# Altium schematic sheet CPU_GPIO.SchDoc
size 420 x 297 mm; Scale: 1:1; DocumentType: Схема электрическая принципиальная; SheetNumber: 11; SheetTotal: 32; DocumentTypeShort: Э3; DocumentInvertoryNumber: ㅤ
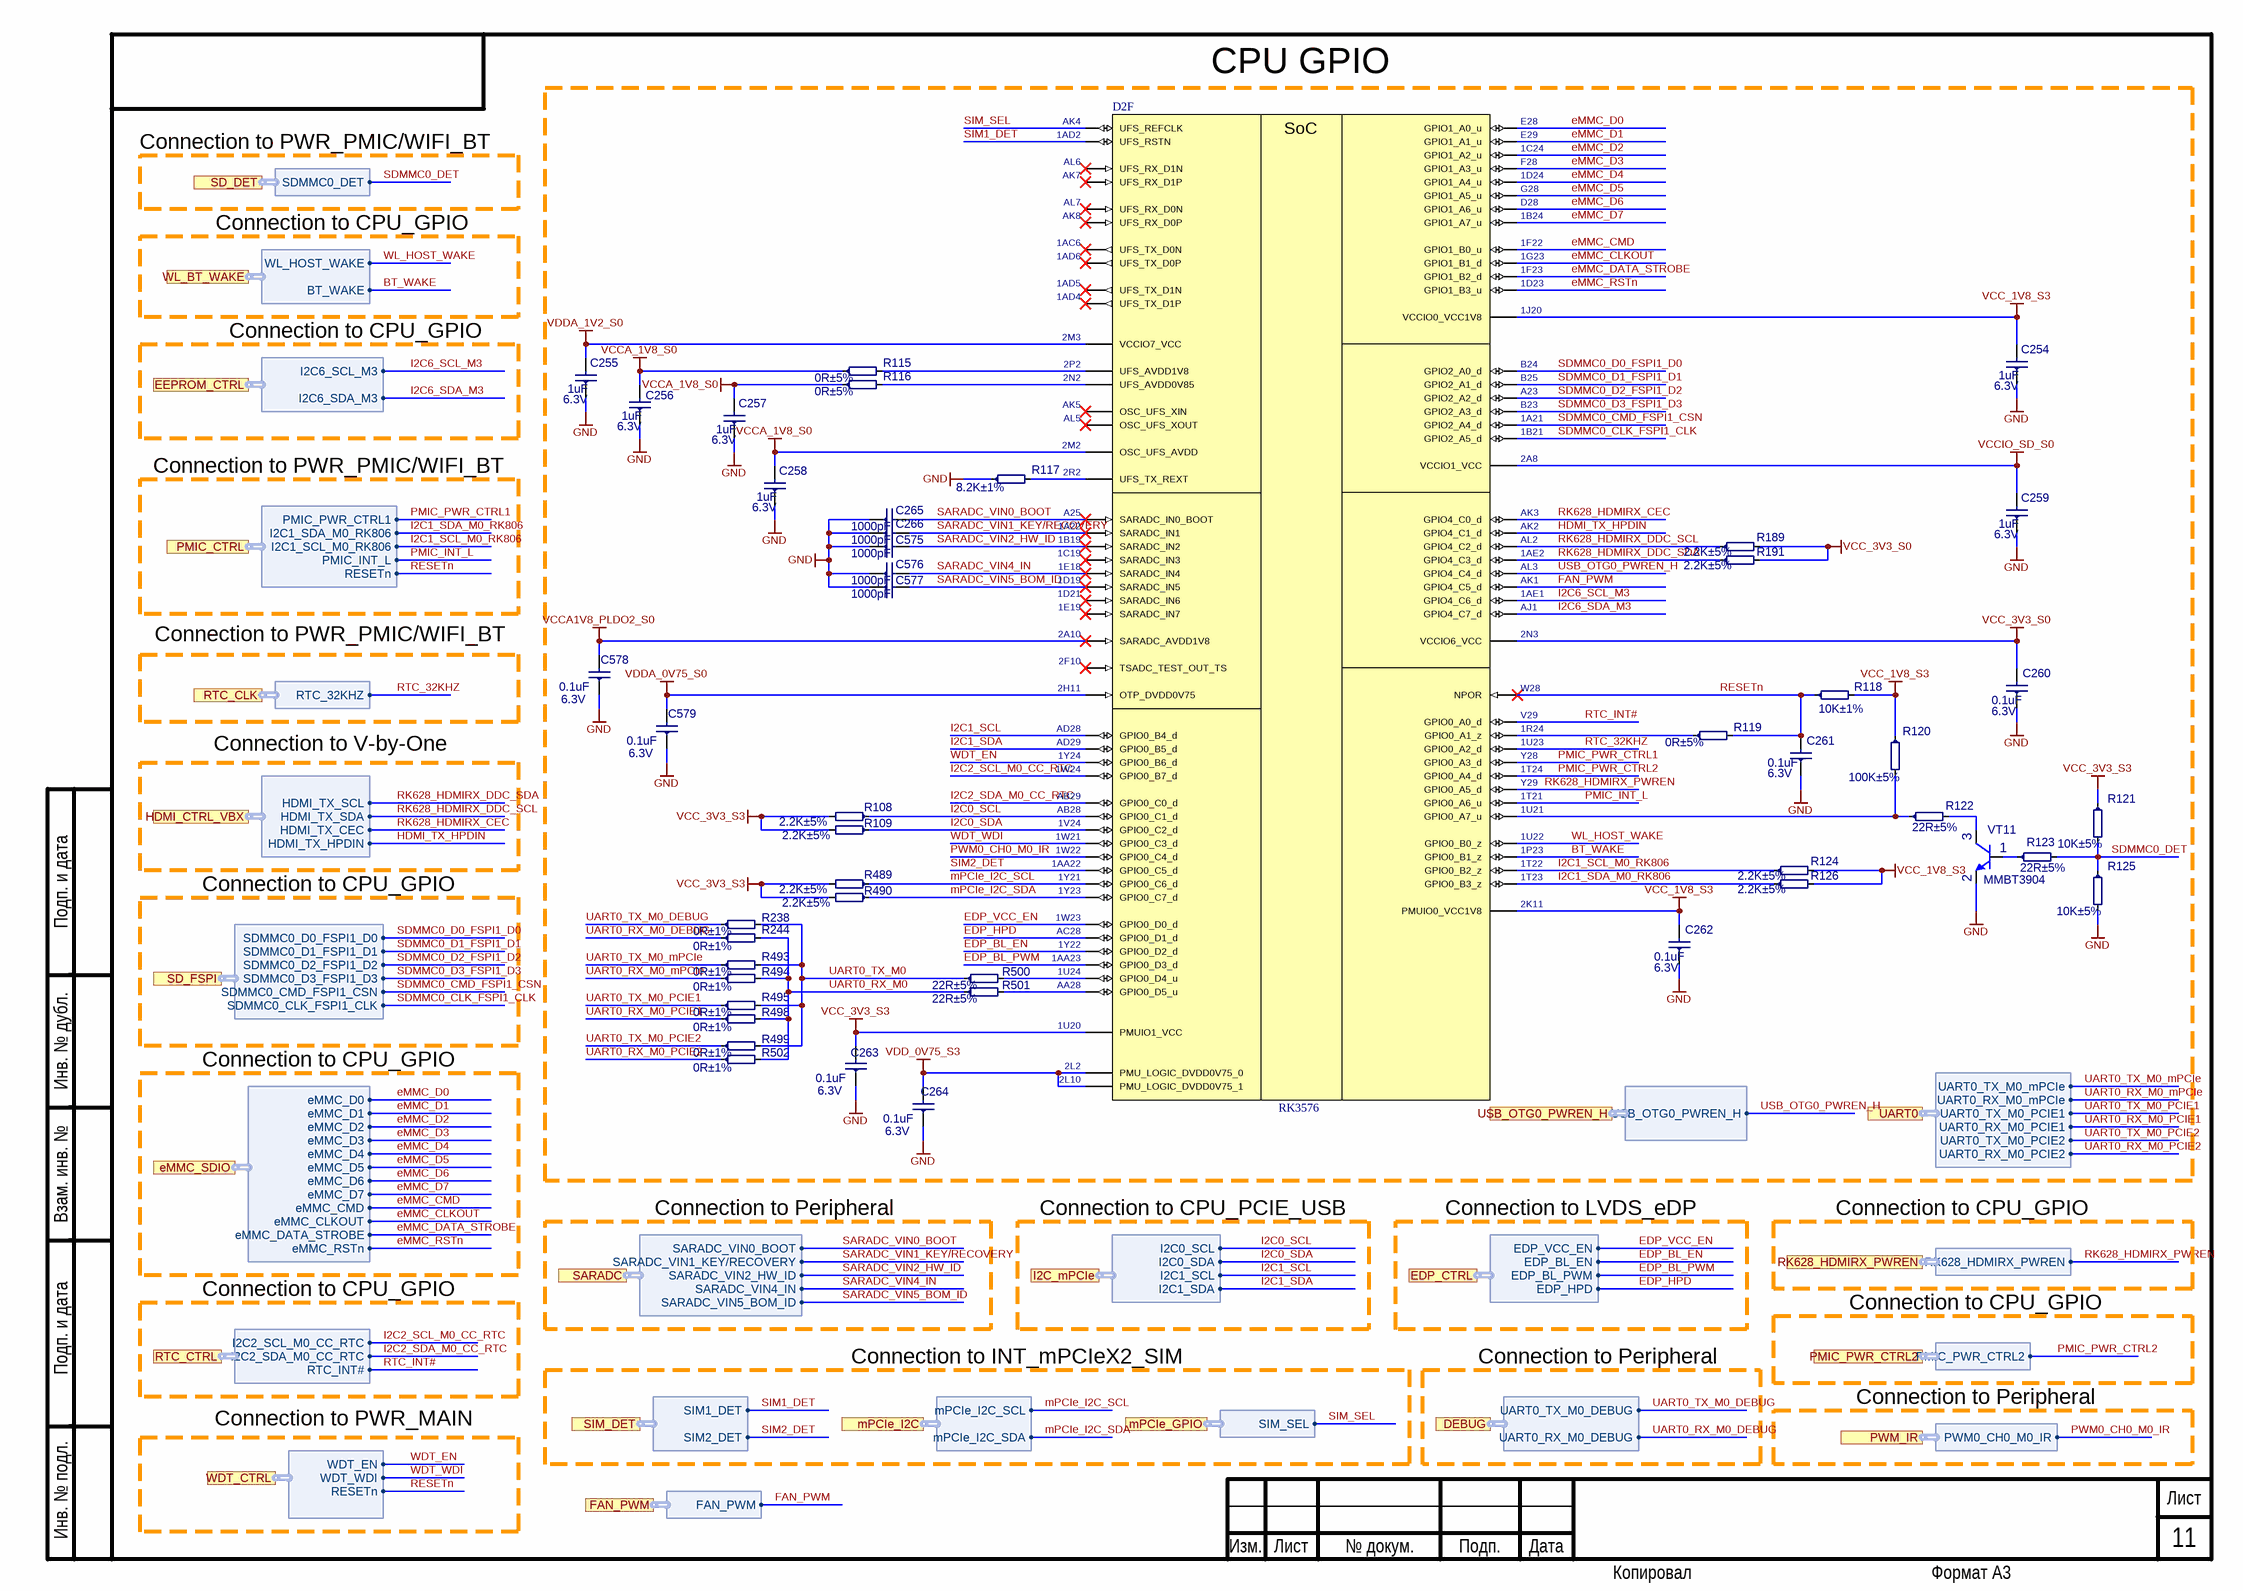
[diagram p0: CPU_GPIO.SchDoc]

## Parts
C254  1uF  Voltage: 6.3V  [C0201]
C255  1uF  Voltage: 6.3V  [C0201]
C256  1uF  Voltage: 6.3V  [C0201]
C257  1uF  Voltage: 6.3V  [C0201]
C258  1uF  Voltage: 6.3V  [C0201]
C259  1uF  Voltage: 6.3V  [C0201]
C260  0.1uF  Voltage: 6.3V  [C0201]
C261  0.1uF  Voltage: 6.3V  [C0201]
C262  0.1uF  Voltage: 6.3V  [C0201]
C263  0.1uF  Voltage: 6.3V  [C0201]
C264  0.1uF  Voltage: 6.3V  [C0201]
C265  1000pF  [C0201]
C266  1000pF  [C0201]
C575  1000pF  [C0201]
C576  1000pF  [C0201]
C577  1000pF  [C0201]
C578  0.1uF  Voltage: 6.3V  [C0201]
C579  0.1uF  Voltage: 6.3V  [C0201]
D2  RK3576  [BGAFCCSP698L]  (part F of 7)
R108  2.2K±5%  [R0402]
R109  2.2K±5%  [R0402]
R115  0R±5%  [R0201]
R116  0R±5%  [R0201]
R117  8.2K±1%  [R0402]
R118  10K±1%  [R0201]
R119  0R±5%  [R0201]
R120  100K±5%  [R0402]
R121  10K±5%  [R0402]
R122  22R±5%  [R0402]
R123  22R±5%  [R0402]
R124  2.2K±5%  [R0402]
R125  10K±5%  [R0402]
R126  2.2K±5%  [R0402]
R189  2.2K±5%  [R0402]
R191  2.2K±5%  [R0402]
R238  0R±1%  [R0402]
R244  0R±1%  [R0402]
R489  2.2K±5%  [R0402]
R490  2.2K±5%  [R0402]
R493  0R±1%  [R0402]
R494  0R±1%  [R0402]
R495  0R±1%  [R0402]
R498  0R±1%  [R0402]
R499  0R±1%  [R0402]
R500  22R±5%  [R0402]
R501  22R±5%  [R0402]
R502  0R±1%  [R0402]
VT11  MMBT3904  [SOT23]

## Ports
DEBUG (harness DEBUG), EDP_CTRL (harness EDP_CTRL), EEPROM_CTRL (harness EEPROM_CTRL), eMMC_SDIO (harness eMMC_SDIO), FAN_PWM (harness FAN_PWM), HDMI_CTRL_VBX (harness HDMI_CTRL_VBX), I2C_mPCIe (harness I2C_mPCIe), mPCIe_GPIO (harness mPCIe_GPIO), mPCIe_I2C (harness mPCIe_I2C), PMIC_CTRL (harness PMIC_CTRL), PMIC_PWR_CTRL2 (harness PMIC_PWR_CTRL2), PWM_IR (harness PWM0_IR), RK628_HDMIRX_PWREN (harness RK628_HDMIRX_PWREN), RTC_CLK (harness RTC_CLK), RTC_CTRL (harness RTC_CTRL), SARADC (harness SARADC), SD_DET (harness SD_DET), SD_FSPI (harness SD_FSPI), SIM_DET (harness SIM_DET), UART0 (harness UART0), USB_OTG0_PWREN_H (harness USB_OTG0_PWREN_H), WDT_CTRL (harness WDT_CTRL), WL_BT_WAKE (harness WL_BT_WAKE)

## Harnesses
WDT_CTRL: WDT_WDI, WDT_EN, RESETn
RTC_CLK: RTC_32KHZ
RTC_CTRL: I2C2_SCL_M0_CC_RTC, I2C2_SDA_M0_CC_RTC, RTC_INT#
eMMC_SDIO: eMMC_D0, eMMC_D1, eMMC_D2, eMMC_D3, eMMC_D4, eMMC_D5, eMMC_D6, eMMC_D7, eMMC_CMD, eMMC_CLKOUT, eMMC_DATA_STROBE, eMMC_RSTn
SD_FSPI: SDMMC0_D0_FSPI1_D0, SDMMC0_D1_FSPI1_D1, SDMMC0_D2_FSPI1_D2, SDMMC0_D3_FSPI1_D3, SDMMC0_CMD_FSPI1_CSN, SDMMC0_CLK_FSPI1_CLK
EEPROM_CTRL: I2C6_SCL_M3, I2C6_SDA_M3
SD_DET: SDMMC0_DET
WL_BT_WAKE: WL_HOST_WAKE, BT_WAKE
HDMI_CTRL_VBX: HDMI_TX_SDA, HDMI_TX_CEC, HDMI_TX_SCL, HDMI_TX_HPDIN
EDP_CTRL: EDP_BL_EN, EDP_BL_PWM, EDP_VCC_EN, EDP_HPD
SARADC: SARADC_VIN4_IN, SARADC_VIN2_HW_ID, SARADC_VIN1_KEY/RECOVERY, SARADC_VIN0_BOOT, SARADC_VIN5_BOM_ID
PMIC_CTRL: I2C1_SDA_M0_RK806, I2C1_SCL_M0_RK806, PMIC_PWR_CTRL1, PMIC_INT_L, RESETn
mPCIe_GPIO: SIM_SEL
SIM_DET: SIM1_DET, SIM2_DET
mPCIe_I2C: mPCIe_I2C_SDA, mPCIe_I2C_SCL
RK628_HDMIRX_PWREN: RK628_HDMIRX_PWREN
PMIC_PWR_CTRL2: PMIC_PWR_CTRL2
PWM0_IR: PWM0_CH0_M0_IR
I2C_mPCIe: I2C0_SDA, I2C1_SCL, I2C0_SCL, I2C1_SDA
DEBUG: UART0_RX_M0_DEBUG, UART0_TX_M0_DEBUG
FAN_PWM: FAN_PWM
UART0: UART0_RX_M0_PCIE2, UART0_TX_M0_PCIE2, UART0_RX_M0_PCIE1, UART0_TX_M0_PCIE1, UART0_RX_M0_mPCIe, UART0_TX_M0_mPCIe
USB_OTG0_PWREN_H: USB_OTG0_PWREN_H

## Nets
GND: C254.1 C255.1 C256.1 C257.1 C258.1 C259.1 C260.1 C261.1 C262.1 C263.1 C264.1 C265.1 C266.1 C575.1 C576.1 C577.1 C578.1 C579.1 R117.1 R125.2 VT11.2(E)
VCC_1V8_S3: C254.2 C262.2 D2.1J20(VCCIO0_VCC1V8) D2.2K11(PMUIO0_VCC1V8) R118.2 R120.1 R124.2 R126.2
VCC_3V3_S0: C260.2 D2.2N3(VCCIO6_VCC) R189.2 R191.2
VCC_3V3_S3: C263.2 D2.1U20(PMUIO1_VCC) R108.2 R109.2 R121.1 R489.2 R490.2
VCCA1V8_PLDO2_S0: C578.2 D2.2A10(SARADC_AVDD1V8)
VCCA_1V8_S0: C256.2 C257.2 C258.2 D2.2M2(OSC_UFS_AVDD) R115.1 R116.1
VCCIO_SD_S0: C259.2 D2.2A8(VCCIO1_VCC)
VDD_0V75_S3: C264.2 D2.2L2(PMU_LOGIC_DVDD0V75_0) D2.2L10(PMU_LOGIC_DVDD0V75_1)
VDDA_0V75_S0: C579.2 D2.2H11(OTP_DVDD0V75)
VDDA_1V2_S0: C255.2 D2.2M3(VCCIO7_VCC)
BT_WAKE: D2.1P23(GPIO0_B1_z) ; port WL_BT_WAKE.BT_WAKE
EDP_BL_EN: D2.1Y22(GPIO0_D2_d) ; port EDP_CTRL.EDP_BL_EN
EDP_BL_PWM: D2.1AA23(GPIO0_D3_d) ; port EDP_CTRL.EDP_BL_PWM
EDP_HPD: D2.AC28(GPIO0_D1_d) ; port EDP_CTRL.EDP_HPD
EDP_VCC_EN: D2.1W23(GPIO0_D0_d) ; port EDP_CTRL.EDP_VCC_EN
eMMC_CLKOUT: D2.1G23(GPIO1_B1_d) ; port eMMC_SDIO.eMMC_CLKOUT
eMMC_CMD: D2.1F22(GPIO1_B0_u) ; port eMMC_SDIO.eMMC_CMD
eMMC_D0: D2.E28(GPIO1_A0_u) ; port eMMC_SDIO.eMMC_D0
eMMC_D1: D2.E29(GPIO1_A1_u) ; port eMMC_SDIO.eMMC_D1
eMMC_D2: D2.1C24(GPIO1_A2_u) ; port eMMC_SDIO.eMMC_D2
eMMC_D3: D2.F28(GPIO1_A3_u) ; port eMMC_SDIO.eMMC_D3
eMMC_D4: D2.1D24(GPIO1_A4_u) ; port eMMC_SDIO.eMMC_D4
eMMC_D5: D2.G28(GPIO1_A5_u) ; port eMMC_SDIO.eMMC_D5
eMMC_D6: D2.D28(GPIO1_A6_u) ; port eMMC_SDIO.eMMC_D6
eMMC_D7: D2.1B24(GPIO1_A7_u) ; port eMMC_SDIO.eMMC_D7
eMMC_DATA_STROBE: D2.1F23(GPIO1_B2_d) ; port eMMC_SDIO.eMMC_DATA_STROBE
eMMC_RSTn: D2.1D23(GPIO1_B3_u) ; port eMMC_SDIO.eMMC_RSTn
FAN_PWM: D2.AK1(GPIO4_C5_d) ; port FAN_PWM.FAN_PWM
HDMI_TX_HPDIN: D2.AK2(GPIO4_C1_d) ; port HDMI_CTRL_VBX.HDMI_TX_HPDIN
I2C0_SCL: D2.AB28(GPIO0_C1_d) R108.1 ; port I2C_mPCIe.I2C0_SCL
I2C0_SDA: D2.1V24(GPIO0_C2_d) R109.1 ; port I2C_mPCIe.I2C0_SDA
I2C1_SCL: D2.AD28(GPIO0_B4_d) ; port I2C_mPCIe.I2C1_SCL
I2C1_SCL_M0_RK806: D2.1T22(GPIO0_B2_z) R124.1 ; port PMIC_CTRL.I2C1_SCL_M0_RK806
I2C1_SDA: D2.AD29(GPIO0_B5_d) ; port I2C_mPCIe.I2C1_SDA
I2C1_SDA_M0_RK806: D2.1T23(GPIO0_B3_z) R126.1 ; port PMIC_CTRL.I2C1_SDA_M0_RK806
I2C2_SCL_M0_CC_RTC: D2.1W24(GPIO0_B7_d) ; port RTC_CTRL.I2C2_SCL_M0_CC_RTC
I2C2_SDA_M0_CC_RTC: D2.AB29(GPIO0_C0_d) ; port RTC_CTRL.I2C2_SDA_M0_CC_RTC
I2C6_SCL_M3: D2.1AE1(GPIO4_C6_d) ; port EEPROM_CTRL.I2C6_SCL_M3
I2C6_SDA_M3: D2.AJ1(GPIO4_C7_d) ; port EEPROM_CTRL.I2C6_SDA_M3
mPCIe_I2C_SCL: D2.1Y21(GPIO0_C6_d) R489.1 ; port mPCIe_I2C.mPCIe_I2C_SCL
mPCIe_I2C_SDA: D2.1Y23(GPIO0_C7_d) R490.1 ; port mPCIe_I2C.mPCIe_I2C_SDA
PMIC_INT_L: D2.1T21(GPIO0_A6_u) ; port PMIC_CTRL.PMIC_INT_L
PMIC_PWR_CTRL1: D2.Y28(GPIO0_A3_d) ; port PMIC_CTRL.PMIC_PWR_CTRL1
PMIC_PWR_CTRL2: D2.1T24(GPIO0_A4_d) ; port PMIC_PWR_CTRL2.PMIC_PWR_CTRL2
PWM0_CH0_M0_IR: D2.1W22(GPIO0_C4_d) ; port PWM_IR.PWM0_CH0_M0_IR
RESETn: C261.2 D2.W28(NPOR) R118.1 R119.2 ; port WDT_CTRL.RESETn, port PMIC_CTRL.RESETn
RK628_HDMIRX_CEC: D2.AK3(GPIO4_C0_d) ; port HDMI_CTRL_VBX.HDMI_TX_CEC
RK628_HDMIRX_DDC_SCL: D2.AL2(GPIO4_C2_d) R189.1 ; port HDMI_CTRL_VBX.HDMI_TX_SDA
RK628_HDMIRX_DDC_SDA: D2.1AE2(GPIO4_C3_d) R191.1 ; port HDMI_CTRL_VBX.HDMI_TX_SCL
RK628_HDMIRX_PWREN: D2.Y29(GPIO0_A5_d) ; port RK628_HDMIRX_PWREN.RK628_HDMIRX_PWREN
RTC_32KHZ: D2.1U23(GPIO0_A2_d) ; port RTC_CLK.RTC_32KHZ
RTC_INT#: D2.V29(GPIO0_A0_d) ; port RTC_CTRL.RTC_INT#
SARADC_VIN0_BOOT: C265.2 D2.A25(SARADC_IN0_BOOT) ; port SARADC.SARADC_VIN0_BOOT
SARADC_VIN1_KEY/RECOVERY: C266.2 D2.1A22(SARADC_IN1) ; port SARADC.SARADC_VIN1_KEY/RECOVERY
SARADC_VIN2_HW_ID: C575.2 D2.1B19(SARADC_IN2) ; port SARADC.SARADC_VIN2_HW_ID
SARADC_VIN4_IN: C576.2 D2.1E18(SARADC_IN4) ; port SARADC.SARADC_VIN4_IN
SARADC_VIN5_BOM_ID: C577.2 D2.1D19(SARADC_IN5) ; port SARADC.SARADC_VIN5_BOM_ID
SDMMC0_CLK_FSPI1_CLK: D2.1B21(GPIO2_A5_d) ; port SD_FSPI.SDMMC0_CLK_FSPI1_CLK
SDMMC0_CMD_FSPI1_CSN: D2.1A21(GPIO2_A4_d) ; port SD_FSPI.SDMMC0_CMD_FSPI1_CSN
SDMMC0_D0_FSPI1_D0: D2.B24(GPIO2_A0_d) ; port SD_FSPI.SDMMC0_D0_FSPI1_D0
SDMMC0_D1_FSPI1_D1: D2.B25(GPIO2_A1_d) ; port SD_FSPI.SDMMC0_D1_FSPI1_D1
SDMMC0_D2_FSPI1_D2: D2.A23(GPIO2_A2_d) ; port SD_FSPI.SDMMC0_D2_FSPI1_D2
SDMMC0_D3_FSPI1_D3: D2.B23(GPIO2_A3_d) ; port SD_FSPI.SDMMC0_D3_FSPI1_D3
SDMMC0_DET: R121.2 R123.2 R125.1 ; port SD_DET.SDMMC0_DET
SIM1_DET: D2.1AD2(UFS_RSTN) ; port SIM_DET.SIM1_DET
SIM2_DET: D2.1AA22(GPIO0_C5_d) ; port SIM_DET.SIM2_DET
SIM_SEL: D2.AK4(UFS_REFCLK) ; port mPCIe_GPIO.SIM_SEL
UART0_RX_M0: R244.2 R494.2 R498.2 R501.1 R502.2
UART0_RX_M0_DEBUG: R244.1 ; port DEBUG.UART0_RX_M0_DEBUG
UART0_RX_M0_mPCIe: R494.1 ; port UART0.UART0_RX_M0_mPCIe
UART0_RX_M0_PCIE1: R498.1 ; port UART0.UART0_RX_M0_PCIE1
UART0_RX_M0_PCIE2: R502.1 ; port UART0.UART0_RX_M0_PCIE2
UART0_TX_M0: R238.2 R493.2 R495.2 R499.2 R500.1
UART0_TX_M0_DEBUG: R238.1 ; port DEBUG.UART0_TX_M0_DEBUG
UART0_TX_M0_mPCIe: R493.1 ; port UART0.UART0_TX_M0_mPCIe
UART0_TX_M0_PCIE1: R495.1 ; port UART0.UART0_TX_M0_PCIE1
UART0_TX_M0_PCIE2: R499.1 ; port UART0.UART0_TX_M0_PCIE2
USB_OTG0_PWREN_H: D2.AL3(GPIO4_C4_d) ; port USB_OTG0_PWREN_H.USB_OTG0_PWREN_H
WDT_EN: D2.1Y24(GPIO0_B6_d) ; port WDT_CTRL.WDT_EN
WDT_WDI: D2.1W21(GPIO0_C3_d) ; port WDT_CTRL.WDT_WDI
WL_HOST_WAKE: D2.1U22(GPIO0_B0_z) ; port WL_BT_WAKE.WL_HOST_WAKE
NetD2_1R24: D2.1R24(GPIO0_A1_z) R119.1
NetD2_1U21: D2.1U21(GPIO0_A7_u) R120.2 R122.1
NetD2_1U24: D2.1U24(GPIO0_D4_u) R500.2
NetD2_2N2: D2.2N2(UFS_AVDD0V85) R116.2
NetD2_2P2: D2.2P2(UFS_AVDD1V8) R115.2
NetD2_2R2: D2.2R2(UFS_TX_REXT) R117.2
NetD2_AA28: D2.AA28(GPIO0_D5_u) R501.2
NetR122_2: R122.2 VT11.3(C)
NetR123_1: R123.1 VT11.1(B)

Not connected (* = marked no-connect by the designer): D2 1AC6(UFS_TX_D0N)* 1AD4(UFS_TX_D1P)* 1AD5(UFS_TX_D1N)* 1AD6(UFS_TX_D0P)* 1C19(SARADC_IN3)* 1D21(SARADC_IN6)* 1E19(SARADC_IN7)* 2F10(TSADC_TEST_OUT_TS)* AK5(OSC_UFS_XIN)* AK7(UFS_RX_D1P)* AK8(UFS_RX_D0P)* AL5(OSC_UFS_XOUT)* AL6(UFS_RX_D1N)* AL7(UFS_RX_D0N)*

## Notes on the sheet
- (near D2) CPU GPIO
- Connection to PWR_PMIC/WIFI_BT
- Connection to CPU_GPIO
- Connection to V-by-One
- Connection to Peripheral
- Connection to CPU_PCIE_USB
- Connection to LVDS_eDP
- Connection to INT_mPCIeX2_SIM
- Connection to PWR_MAIN
- Подп. и дата
- Инв. № дубл.
- Взам. инв. №
- Инв. № подл.
- Изм.
- Лист
- № докум.
- Подп.
- Дата
- Копировал
- Формат А3
- (in symbol RK3576, part F) SoC

## Library data of the parts
C254-C259 = 0201-X5R-6.3V-1uF±20%: Manufacturer: Murata Electronics; NameFromManufacturer: GRM033R60J105MEA2D; Dielectric: X5R; Place: *); Tolerance: 20%; Check: False; Case: C0201; Part Number: 0201-X5R-6.3V-1uF±20%; Value: 1uF; Temperature: -55°C~85°C; ComponentLink2Description: Link to datasheet; ComponentLink1Description: DATASHEET; ComponentLink2URL: https://www.terraelectronica.ru/product/1209278; ComponentLink1URL: Datasheets/capacitors/GRM033R60J105MEA2-61A.pdf; Last changed: 27.10.2022
C260-C264 C578 C579 = 0201-X5R-6.3V-0.1uF±10%: Manufacturer: Yageo; NameFromManufacturer: CC0201KRX5R5BB104; Dielectric: X5R; Place: *); Tolerance: 10%; Check: False; Case: C0201; Part Number: 0201-X5R-6.3V-0.1uF±10%; Value: 0.1uF; Temperature: -55°C~85°C; ComponentLink2Description: Link to datasheet; ComponentLink1Description: DATASHEET; ComponentLink2URL: https://www.terraelectronica.ru/product/1020032; ComponentLink1URL: Datasheets/capacitors/UPY-GPHC_X5R_4V-to-50V_27.pdf; Last changed: 27.10.2022
C265 C266 C575-C577 = 0201-C0G-25V-100pF±5%: *; Part Number: 0201-C0G-25V-1000pF±10%; Manufacturer: Yageo; NameFromManufacturer: CC0201KRX7R9BB102; Dielectric: C0G; Voltage: 25V; Place: *); Tolerance: 10%; Check: False; Case: C0201; Value: 1000pF; Temperature: -55°C~125°C; ComponentLink2Description: Link to datasheet; ComponentLink1Description: DATASHEET; ComponentLink2URL: https://ru.mouser.com/ProductDetail/YAGEO/CC0201JRNPO8BN101?qs=%2Fha2pyFaduhl6p6a7Jtfij5kOT7C0BCbN0eDEcSOi5wWtTVDmUsGTw%3D%3D; ComponentLink1URL: Datasheets/capacitors/UPY-GP_NP0_16V-to-50V_18.pdf; Last changed: 27.10.2022
D2 = RK3576: SoC 4xCortex-A72@2.2Ghz+4xCortex-A53@2Ghz, LPDDR4/4X/5/5X, SDIO/eMMC/UFS/FSPI, BGA 16.1x17.2x1.0mm; Manufacturer: Rockship; Place: *); Check: False; Part Number: RK3576; Temperature: -40°C~85°C; Value: RK3576; ComponentLink1Description: DATASHEET; NameFromManufacturer: RK3576; ComponentLink1URL: https://wiki.friendlyelec.com/wiki/images/b/bf/Rockchip_RK3576_Datasheet_V1.5-20241216.pdf; Last changed: 06.01.2026
R108 R109 R124 R126 R189 R191 R489 R490 = 0402-0.0625W-2.2K-100ppm±5%: *; NameFromManufacturer: RC0402JR-072K2L; Manufacturer: Yageo; Place: *); Value: 2.2K; Tolerance: 5%; Check: False; Case: R0402; Part Number: 0402-0.0625W-2.2K-100ppm±5%; Temperature: -55°C~155°C; ComponentLink1Description: DATASHEET; ComponentLink1URL: https://octopart.com/ac0402jr-072k2l-yageo-23514430?r=sp; Datasheet: Datasheets/resistors/PYu-AC_51_RoHS_L_8.pdf; Last changed: 27.10.2022
R115 R116 R119 = 0201-0.05W-0R-100ppm-5%: *; NameFromManufacturer: RC0201JR-070RL; Manufacturer: Yageo; Place: *); Value: 0R; Tolerance: 5%; Check: False; Case: R0201; Part Number: 0201-0.05W-0R-100ppm-5%; Temperature: -40°C~125°C; ComponentLink1Description: DATASHEET; ComponentLink1URL: https://www.digikey.com/en/products/detail/yageo/RC0201JR-070RL/1948898; Datasheet: Datasheets/resistors/PYu-RC_Group_51_RoHS_L_11.pdf+BB3:B271; Last changed: 27.10.2022
R117 = 0402-0.0625W-8.2K-100ppm±1%: NameFromManufacturer: RC0402FR-078K2L; Manufacturer: Yageo; Place: *); Value: 8.2K; Tolerance: 1%; Check: False; Case: R0402; Part Number: 0402-0.0625W-8.2K-100ppm±1%; Temperature: -55°C~155°C; ComponentLink1Description: DATASHEET; ComponentLink1URL: https://www.compel.ru/infosheet/YAG/RC0402FR-078K2L; Datasheet: Datasheets/resistors/PYu-RC_Group_51_RoHS_L_11.pdf; Last changed: 27.10.2022
R118 = 0201-0.05W-10K-200ppm-1%: *; NameFromManufacturer: RC0201FR-0710KL; Manufacturer: Yageo; Place: *); Value: 10K; Tolerance: 1%; Check: False; Case: R0201; Part Number: 0201-0.05W-10K-200ppm-1%; Temperature: -40°C~125°C; ComponentLink1Description: DATASHEET; ComponentLink1URL: https://www.terraelectronica.ru/product/597744; Datasheet: Datasheets/resistors/PYu-RC_Group_51_RoHS_L_11.pdf; Last changed: 09.11.2022
R120 = 0402-0.0625W-100K-100ppm±5%: NameFromManufacturer: RC0402JR-07100KL; Manufacturer: Yageo; Place: *); Value: 100K; Tolerance: 5%; Check: False; Case: R0402; Part Number: 0402-0.0625W-100K-100ppm±5%; Temperature: -55°C~155°C; ComponentLink1Description: DATASHEET; ComponentLink1URL: https://ru.mouser.com/ProductDetail/YAGEO/RC0402JR-07100KL?qs=%2Fha2pyFadugNN0LzwXn2qCsICuw6vgLBeLL%252BmXUKy2OLGS9kgqrNBA%3D%3D; Datasheet: Datasheets/resistors/PYu-RC_Group_51_RoHS_L_11.pdf; Last changed: 27.10.2022
R121 R125 = 0402-0.0625W-10K-100ppm±5%: NameFromManufacturer: RC0402JR-0710KL; Manufacturer: Yageo; Place: *); Value: 10K; Tolerance: 5%; Check: False; Case: R0402; Part Number: 0402-0.0625W-10K-100ppm±5%; Temperature: -55°C~155°C; ComponentLink1Description: DATASHEET; ComponentLink1URL: https://ru.mouser.com/ProductDetail/YAGEO/RC0402JR-0710KL?qs=%2Fha2pyFadugNN0LzwXn2qF8HRAp201xOpXu%252BapQnyvRGE%2F%252Bpr1TWjQ%3D%3D; Datasheet: Datasheets/resistors/PYu-RC_Group_51_RoHS_L_11.pdf; Last changed: 27.10.2022
R122 R123 R500 R501 = 0402-0.0625W-22R-100ppm±5%: NameFromManufacturer: RC0402JR-0722RL; Manufacturer: Yageo; Place: *); Value: 22R; Tolerance: 5%; Check: False; Case: R0402; Part Number: 0402-0.0625W-22R-100ppm±5%; Temperature: -55°C~155°C; ComponentLink1Description: DATASHEET; ComponentLink1URL: https://www.terraelectronica.ru/pdf/show?pdf_file=%252Fds%252Fpdf%252FR%252FRC0402.pdf; Datasheet: Datasheets/resistors/PYu-RC_Group_51_RoHS_L_12.pdf; Last changed: 27.10.2022
R238 R244 R493-R495 R498 R499 R502 = 0402-0.0625W-0R-100ppm±1%: Chip Resistor 0402 0Ω ±1% 50V ±100ppm/℃ Thick Film; NameFromManufacturer: RC0402FR-070RL; Manufacturer: Yageo; Place: *); Value: 0R; Check: False; Case: R0402; Part Number: 0402-0.0625W-0R-100ppm±1%; Tolerance: 1%; Temperature: -55°C~155°C; ComponentLink1Description: DATASHEET; ComponentLink1URL: https://www.chipdip.ru/product0/8000617426?ysclid=l7og5x0plo427794326; Datasheet: Datasheets/resistors/DOC012445956.pdf; Last changed: 27.10.2022
VT11 = MMBT3904: NPN transistor; Manufacturer: Diotec Semiconductor; Place: S; Voltage: 40V; Check: False; Part Number: MMBT3904; Value: MMBT3904; Temperature: -55°C~150°C; ComponentLink1Description: DATASHEET; NameFromManufacturer: MMBT3904; ComponentLink1URL: https://www.terraelectronica.ru/product/607582; Datasheet: #https://diotec.com/request/datasheet/mmbt3904.pdf#; Last changeв: 01.09.2022